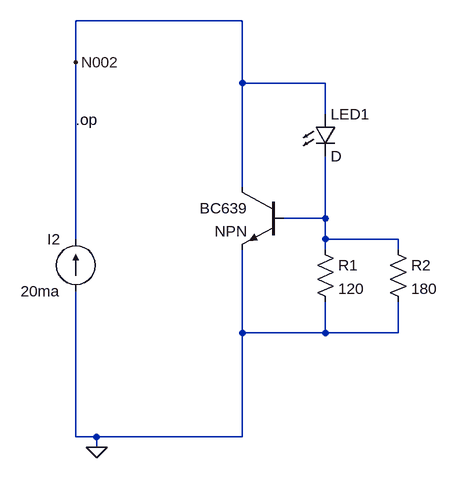
[diagram p0: schematic tty-led-driver.asc]
tty-led-driver.asc, the LTspice schematic file:
Version 4
SHEET 1 880 688
WIRE 240 16 -16 16
WIRE -16 80 -16 16
WIRE 240 112 240 16
WIRE 368 112 240 112
WIRE 368 160 368 112
WIRE 240 272 240 112
WIRE 368 320 368 224
WIRE 368 320 304 320
WIRE -16 352 -16 80
WIRE 368 352 368 320
WIRE 480 352 368 352
WIRE 368 368 368 352
WIRE 480 368 480 352
WIRE 240 496 240 368
WIRE 368 496 368 448
WIRE 368 496 240 496
WIRE 480 496 480 448
WIRE 480 496 368 496
WIRE -16 656 -16 432
WIRE 16 656 -16 656
WIRE 240 656 240 496
WIRE 240 656 16 656
WIRE 16 672 16 656
FLAG -16 80 N002
FLAG 16 672 0
SYMBOL res 352 352 R0
SYMATTR InstName R1
SYMATTR Value 120
SYMBOL npn3 304 272 M0
SYMATTR InstName BC639
SYMBOL current -16 432 R180
WINDOW 0 24 80 Left 2
WINDOW 3 24 0 Left 2
SYMATTR InstName I2
SYMATTR Value 20ma
SYMBOL LED 352 160 R0
SYMATTR InstName LED1
SYMBOL res 464 352 R0
SYMATTR InstName R2
SYMATTR Value 180
TEXT -16 168 Left 2 !.op

The netlist it stands for:
* tty-led-driver.asc
R1 N001 0 120
Q§BC639 N002 N001 0 0 NPN
I2 0 N002 20ma
D§LED1 N002 N001 D
R2 N001 0 180
.model D D
.lib standard.dio
.model NPN NPN
.model PNP PNP
.lib standard.bjt
.op
.backanno
.end